# Altium schematic sheet Схема блока RFID.SchDoc
size 420 x 297 mm; Address1: Address1; Address2: Address2; Address3: Address3; Address4: Address4; DocumentNumber: АБВГ.123456.001 Э3; SheetNumber: 1; Scale: 1:1; DocumentType: Схема электрическая принципиальная; FirstReferrence: АБВГ.123456.001
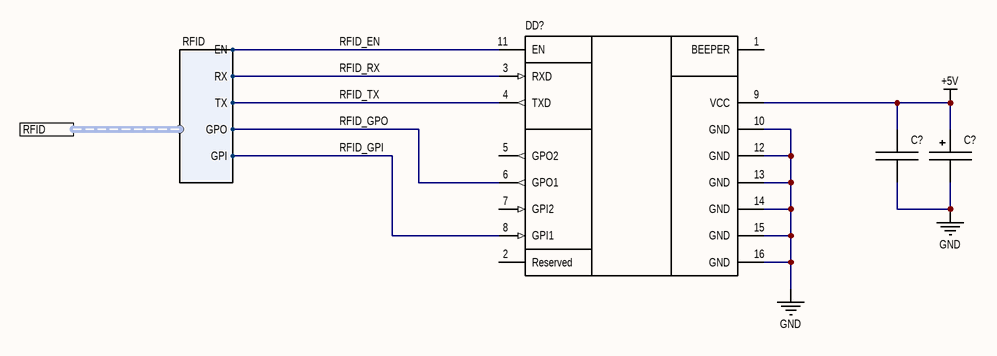
[diagram p0: Схема блока RFID.SchDoc]

## Parts
(Parts that share a designator on the sheet are numbered #1, #2 ... from top to bottom, then left to right.)
C?#1  *  [CH0603C]  (value not drawn)
C?#2  *  [TANTAL_A]  (value not drawn)
DD?  CF-MU904  [MOD: CF-MU904]  (value not drawn)

## Ports
RFID (harness RFID)

## Harnesses
RFID: GPO, GPI, EN, TX, RX

## Nets
+5V: C?#1.1 C?#2.1 DD?.9(VCC)
GND: C?#1.2 C?#2.2 DD?.10(GND) DD?.12(GND) DD?.13(GND) DD?.14(GND) DD?.15(GND) DD?.16(GND)
RFID_EN: DD?.11(EN) ; port RFID.EN
RFID_GPI: DD?.8(GPI1) ; port RFID.GPI
RFID_GPO: DD?.6(GPO1) ; port RFID.GPO
RFID_RX: DD?.3(RXD) ; port RFID.RX
RFID_TX: DD?.4(TXD) ; port RFID.TX

Not connected (* = marked no-connect by the designer): DD? 1(BEEPER) 2(Reserved) 5(GPO2) 7(GPI2)

## Notes on the sheet
- Подп. и дата
- Инв. № дубл.
- Взам. инв. №
- Инв. № подл.
- Изм.
- Лист
- № докум.
- Подп.
- Дата
- 2.106-A3
- Копировал
- Формат А3

## Library data of the parts
C?#1 = Capacitor: Manufacturer: *; Model: *; HelpURL: *; ComponentKind: *; Value: *
C?#2 = TantalCap: Manufacturer: *; Model: *; HelpURL: *; ComponentKind: *; Value: *
DD? = CF-MU904: UHF RFID reader module; Manufacturer: Chafon Technology Co.; Model: CF-MU904; ComponentKind: SMD; HelpURL: http://www.chafon.com/productdetails.aspx?pid=565